# EAGLE board imix (EAGLE 7.5.0)
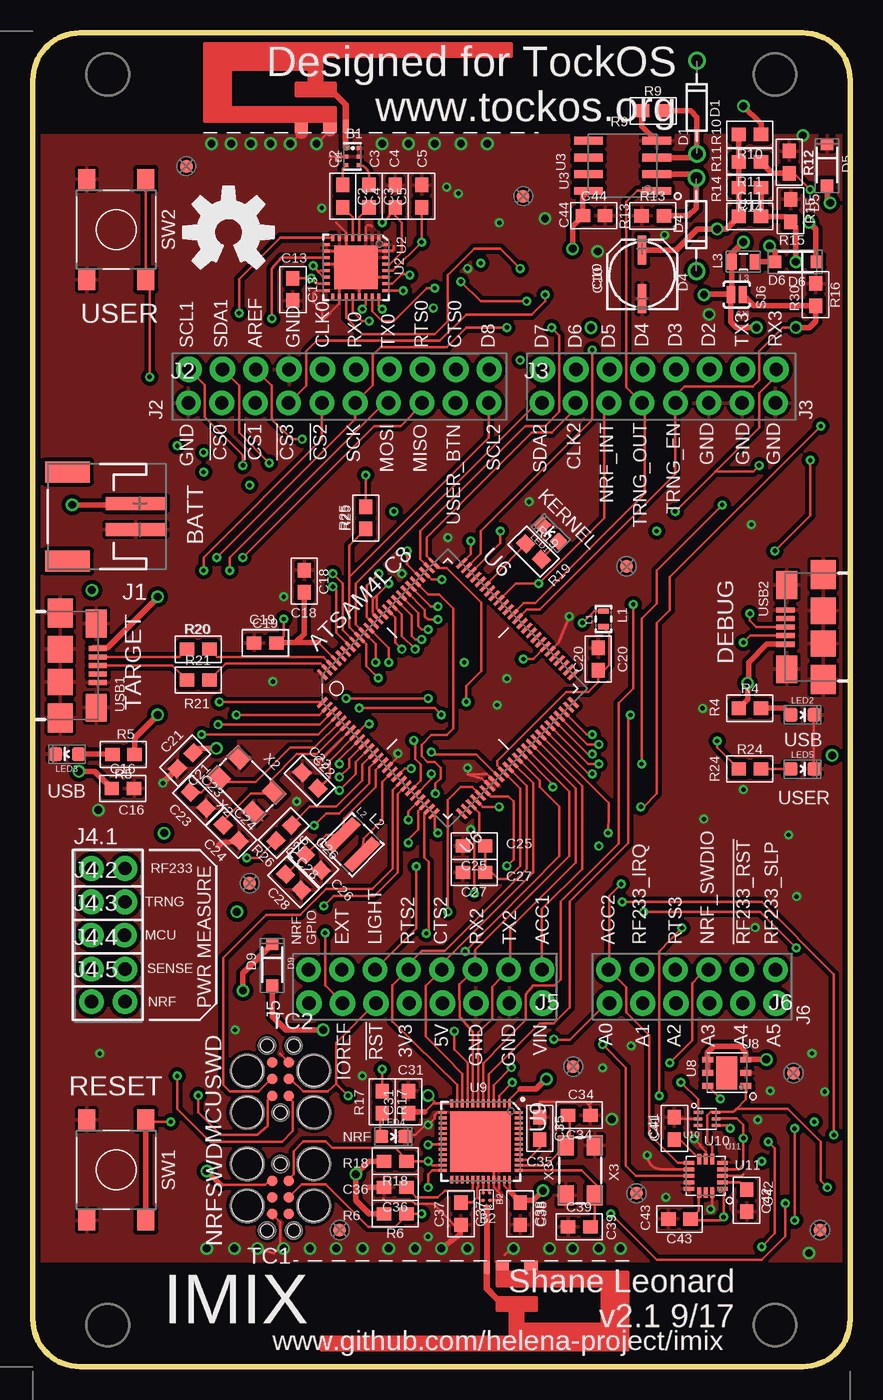
[diagram p8: board, top side]
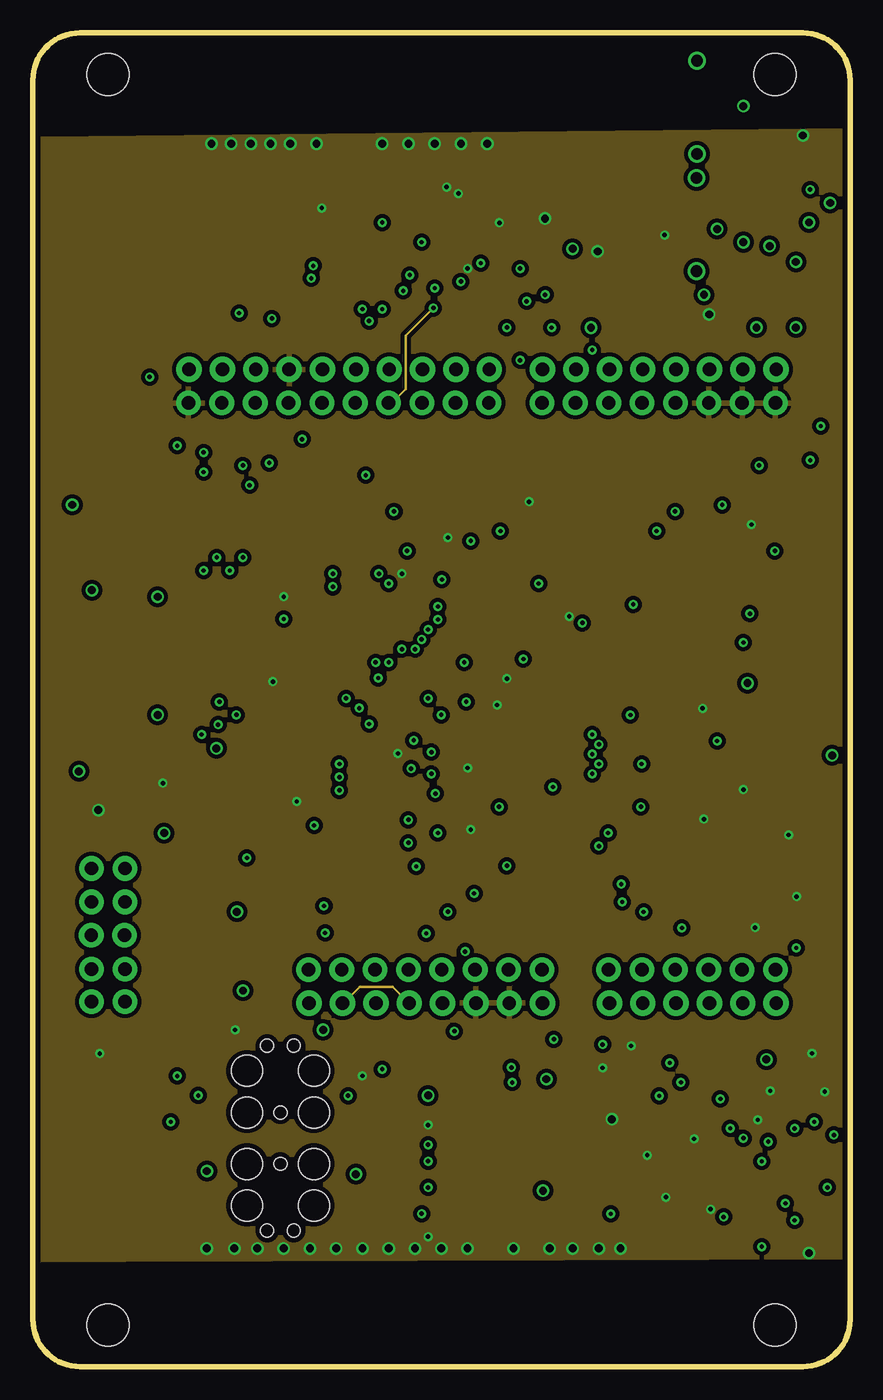
[diagram p9: board, inner layer Route2]
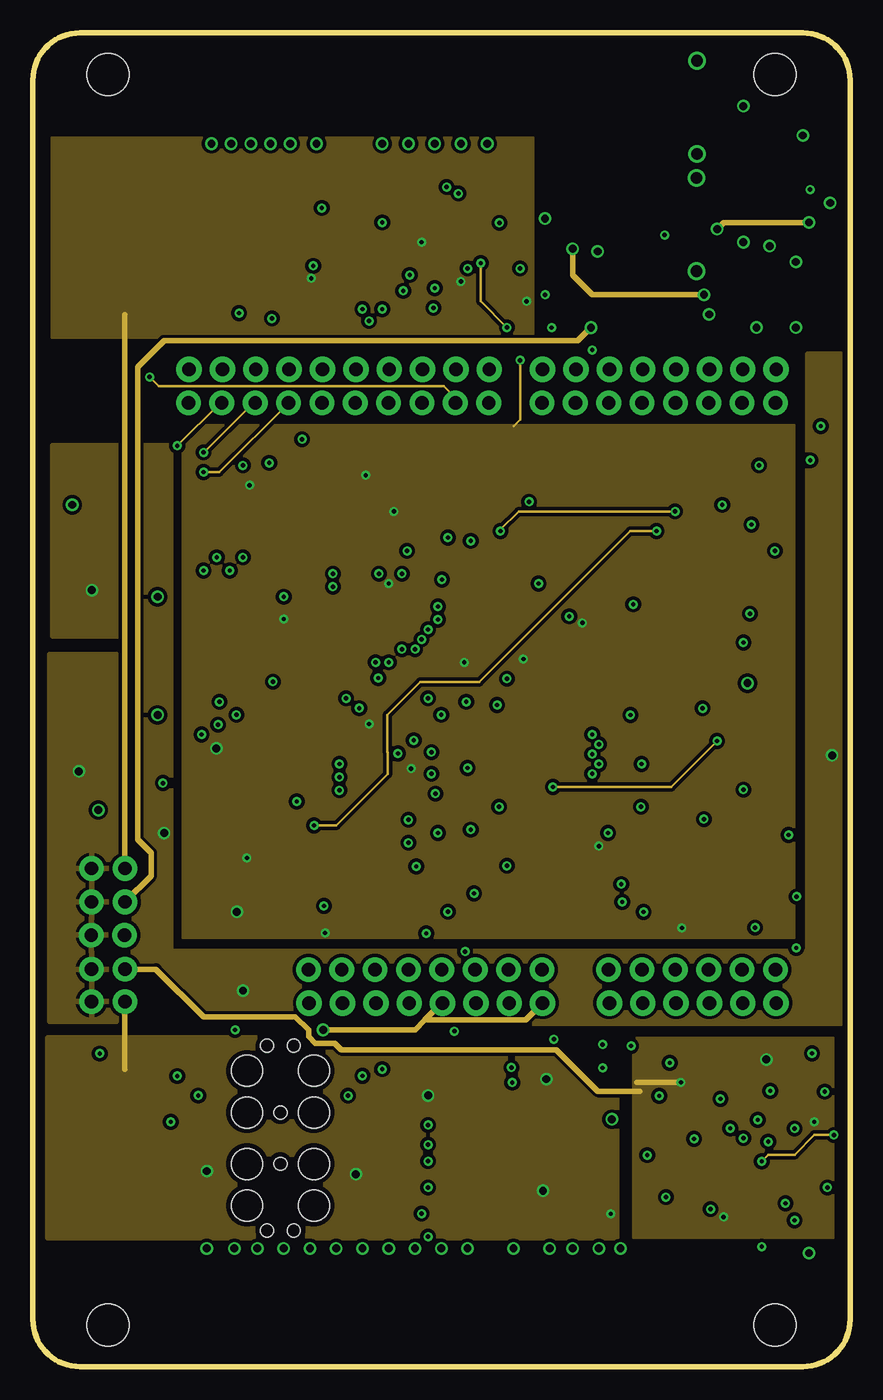
[diagram p10: board, inner layer Route15]
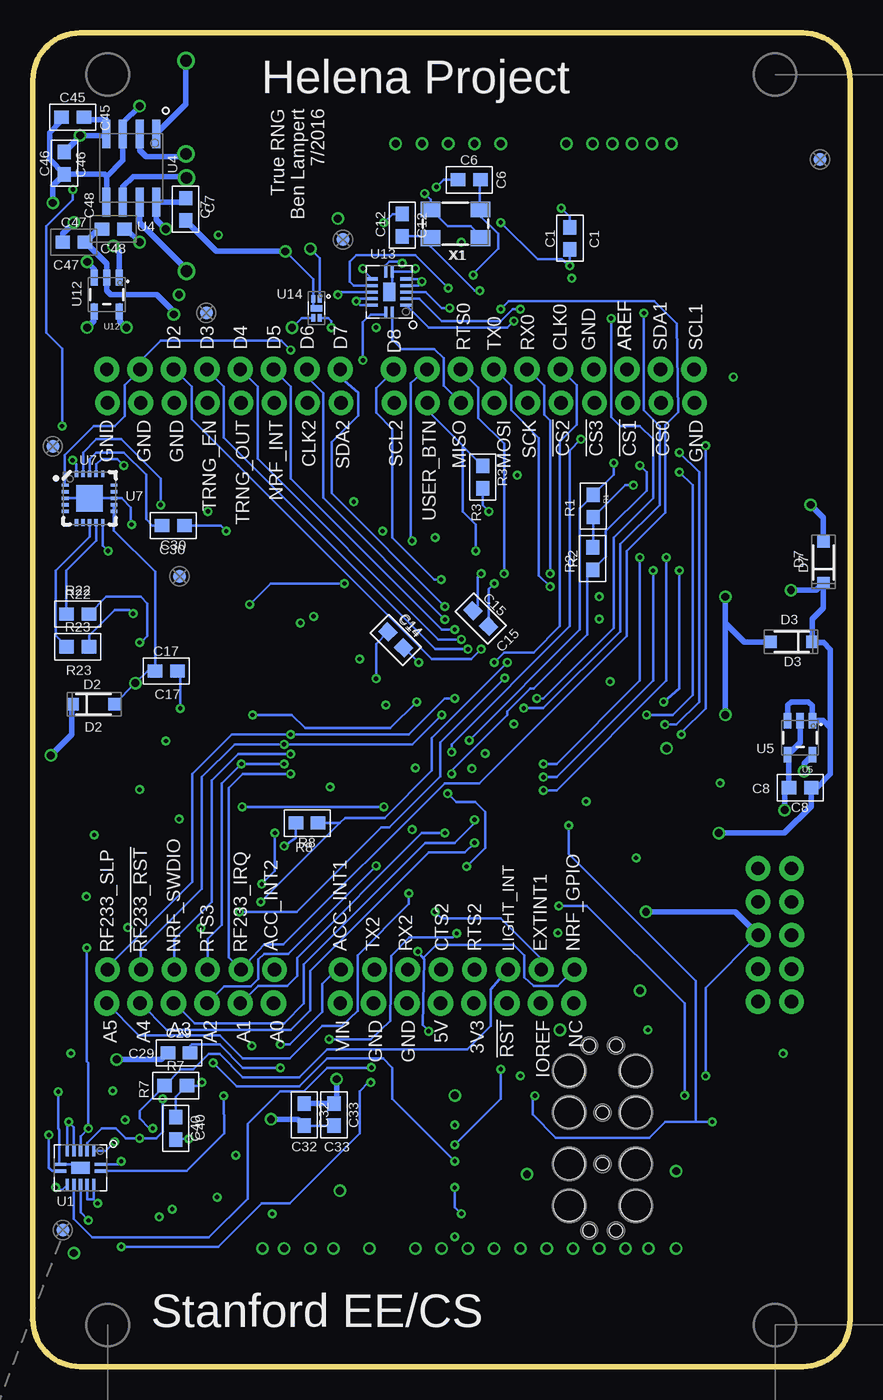
[diagram p11: board, bottom side, seen from below]

Size 62.23 x 101.6 mm. Coordinates in mm from the lower left corner, seen from the top.
Outline: 3.59,101.6 58.64,101.6 arc-90 62.23,98.01 62.23,3.59 arc-90 58.64,0 3.59,0 arc-90 0,3.59 0,98.01 arc-90 3.59,101.6
Copper layers (1+2*15+16): Top 0.0356mm / dielectric 9mil / Route2 0.0356mm / dielectric 40mil / Route15 0.0356mm / dielectric 9mil / Bottom 0.0356mm
Design rules "oshpark-2layer *": minimum track width 8mil, minimum drill 13mil, track to track 6mil, track to pad 6mil, pad to pad 6mil, via to via 6mil, smd to smd 6mil, copper to edge 15mil, drill to drill 6mil, minimum pad ring 7mil, minimum via ring 7mil, stop-mask expansion 2.5mil, vias tented up to drill 13mil, thermal gap 10mil
Net classes: 0 default: width 0.152 mm, drill 0.33 mm, clearance 0.152 mm; 1 power: width 0.152 mm, drill 0.33 mm, clearance 0.254 mm; 2 50ohm: width 0.152 mm, drill 0.33 mm, clearance 0.254 mm
Holes 3.2 mm at 5.71,98.42 56.52,98.42 5.71,3.17 56.52,3.17

## Footprints (pad centres in the part's own frame; a part is rotated, then mirrored left to right if it is on the bottom)
BALUN0805 = smd 0.3 x 0.3: 1 1.65,1.1; 2 1,1.1; 3 0.35,1.1; 4 0.35,0.15; 5 1,0.15; 6 1.65,0.15
BAL_NRF01D3 = smd 0.264 x 0.264: DIFF@1 0.219,0.25; DIFF@2 0.219,0.75; GND 0.819,0.75; SE 1.252,0.5; VCC 0.819,0.25
C0603 = smd 1.1 x 1: 1 -0.85,0; 2 0.85,0
PANASONIC_C = smd 2.2 x 0.65: + 1.9,-0.2; - -1.8,-0.2
C0603-NOSILK = smd 1.1 x 1: 1 -0.85,0; 2 0.85,0
DIODE-ZENER = drill 0.9: P$1 -3.556,0; P$2 3.556,0
SOD-123 = smd 0.9 x 0.95: A 1.575,0; C -1.575,0
JST-2-SMD = smd 1 x 4.6: 1 -1,-3.7; 2 1,-3.7 | smd 1.6 x 3.4: NC1 -3.4,1.5; NC2 3.4,1.5
1X10_NO_SILK = drill 1.016 pad 1.88: 1 0,0; 2 2.54,0; 3 5.08,0; 4 7.62,0; 5 10.16,0; 6 12.7,0; 7 15.24,0; 8 17.78,0; 9 20.32,0; 10 22.86,0
1X08_NO_SILK = drill 1.016 pad 1.88: 1 0,0; 2 2.54,0; 3 5.08,0; 4 7.62,0; 5 10.16,0; 6 12.7,0; 7 15.24,0; 8 17.78,0
1X02_NO_SILK = drill 1.016 pad 1.88: 1 0,0; 2 2.54,0
1X06_NO_SILK = drill 1.016 pad 1.88: 1 0,0; 2 2.54,0; 3 5.08,0; 4 7.62,0; 5 10.16,0; 6 12.7,0
ARDUINO_R3_NO_HOLES_NO_SPI = drill 1.016 pad 1.93: 3.3V 35.56,2.54; 5V 38.1,2.54; A0 50.8,2.54; A1 53.34,2.54; A2 55.88,2.54; A3 58.42,2.54; A4 60.96,2.54; A5 63.5,2.54; AREF 23.876,50.8; D0 63.5,50.8; D1 60.96,50.8; D2 58.42,50.8; D3 55.88,50.8; D4 53.34,50.8; D5 50.8,50.8; D6 48.26,50.8; D7 45.72,50.8; D8 41.656,50.8; D9 39.116,50.8; D10 36.576,50.8; D11 34.036,50.8; D12 31.496,50.8; D13 28.956,50.8; GND@1 40.64,2.54; GND@2 43.18,2.54; GND@3 26.416,50.8; IOREF 30.48,2.54; NC 27.94,2.54; RESET@1 33.02,2.54; SCL 18.796,50.8; SDA 21.336,50.8; VIN 45.72,2.54
L0603 = smd 0.4 x 0.8: 1 0.2,0.4; 2 1.4,0.4
L1212 = smd 0.9 x 3: 1 -1.05,0; 2 1.05,0
0805 = smd 0.8 x 1.2: 1 -0.9,0; 2 0.9,0
LED-0603 = smd 1 x 1: A 0,-0.877; C 0,0.877
0603-RES = smd 1.1 x 1: 1 -0.85,0; 2 0.85,0
SJ_2S-NO = smd 0.635 x 1.27: 1 -0.45,0; 2 0.45,0
TAC_SWITCH_6X6 = smd 1.55 x 1.3: 1 -3.825,2.25; 2 3.825,2.25; 3 -3.825,-2.25; 4 3.825,-2.25
TC2030-IDC = smd 0.787 x 0.787: 1 -1.27,-0.635; 2 -1.27,0.635; 3 0,-0.635; 4 0,0.635; 5 1.27,-0.635; 6 1.27,0.635 | hole 0.991: -2.54,0; 2.54,1.016; 2.54,-1.016 | hole 2.375: -2.54,2.54; -2.54,-2.54; 0.635,2.54; 0.635,-2.54
DHVQFN14 = smd 0.9 x 0.24: 1 -1.55,-0.25; 7 1.55,-0.25; 8 1.55,0.25; 14 -1.55,0.25 | smd 0.24 x 0.9: 2 -1,-1.3; 3 -0.5,-1.3; 4 0,-1.3; 5 0.5,-1.3; 6 1,-1.3; 9 1,1.3; 10 0.5,1.3; 11 0,1.3; 12 -0.5,1.3; 13 -1,1.3 | smd 1.4 x 0.9: PADDLE 0,0
32QN2 = smd 0.5 x 0.23: 1 -2.25,1.75; 2 -2.25,1.25; 3 -2.25,0.75; 4 -2.25,0.25; 5 -2.25,-0.25; 6 -2.25,-0.75; 7 -2.25,-1.25; 8 -2.25,-1.75; 17 2.25,-1.75; 18 2.25,-1.25; 19 2.25,-0.75; 20 2.25,-0.25; 21 2.25,0.25; 22 2.25,0.75; 23 2.25,1.25; 24 2.25,1.75 | smd 0.23 x 0.5: 9 -1.75,-2.25; 10 -1.25,-2.25; 11 -0.75,-2.25; 12 -0.25,-2.25; 13 0.25,-2.25; 14 0.75,-2.25; 15 1.25,-2.25; 16 1.75,-2.25; 25 1.75,2.25; 26 1.25,2.25; 27 0.75,2.25; 28 0.25,2.25; 29 -0.25,2.25; 30 -0.75,2.25; 31 -1.25,2.25; 32 -1.75,2.25 | smd 3.3 x 3.3: PADDLE 0,0
SO8 = smd 0.6 x 2.2: 1 -1.905,-2.6; 2 -0.635,-2.6; 3 0.635,-2.6; 4 1.905,-2.6; 5 1.905,2.6; 6 0.635,2.6; 7 -0.635,2.6; 8 -1.905,2.6
SOT23-5 = smd 0.55 x 1.2: 1 -0.95,-1.3; 2 0,-1.3; 3 0.95,-1.3; 4 0.95,1.3; 5 -0.95,1.3
TQFP100 = smd 1 x 0.25: 1 -7.5,6; 2 -7.5,5.5; 3 -7.5,5; 4 -7.5,4.5; 5 -7.5,4; 6 -7.5,3.5; 7 -7.5,3; 8 -7.5,2.5; 9 -7.5,2; 10 -7.5,1.5; 11 -7.5,1; 12 -7.5,0.5; 13 -7.5,0; 14 -7.5,-0.5; 15 -7.5,-1; 16 -7.5,-1.5; 17 -7.5,-2; 18 -7.5,-2.5; 19 -7.5,-3; 20 -7.5,-3.5; 21 -7.5,-4; 22 -7.5,-4.5; 23 -7.5,-5; 24 -7.5,-5.5; 25 -7.5,-6; 51 7.5,-6; 52 7.5,-5.5; 53 7.5,-5; 54 7.5,-4.5; 55 7.5,-4; 56 7.5,-3.5; 57 7.5,-3; 58 7.5,-2.5; 59 7.5,-2; 60 7.5,-1.5; 61 7.5,-1; 62 7.5,-0.5; 63 7.5,0; 64 7.5,0.5; 65 7.5,1; 66 7.5,1.5; 67 7.5,2; 68 7.5,2.5; 69 7.5,3; 70 7.5,3.5; 71 7.5,4; 72 7.5,4.5; 73 7.5,5; 74 7.5,5.5; 75 7.5,6 | smd 0.25 x 1: 26 -6,-7.5; 27 -5.5,-7.5; 28 -5,-7.5; 29 -4.5,-7.5; 30 -4,-7.5; 31 -3.5,-7.5; 32 -3,-7.5; 33 -2.5,-7.5; 34 -2,-7.5; 35 -1.5,-7.5; 36 -1,-7.5; 37 -0.5,-7.5; 38 0,-7.5; 39 0.5,-7.5; 40 1,-7.5; 41 1.5,-7.5; 42 2,-7.5; 43 2.5,-7.5; 44 3,-7.5; 45 3.5,-7.5; 46 4,-7.5; 47 4.5,-7.5; 48 5,-7.5; 49 5.5,-7.5; 50 6,-7.5; 76 6,7.5; 77 5.5,7.5; 78 5,7.5; 79 4.5,7.5; 80 4,7.5; 81 3.5,7.5; 82 3,7.5; 83 2.5,7.5; 84 2,7.5; 85 1.5,7.5; 86 1,7.5; 87 0.5,7.5; 88 0,7.5; 89 -0.5,7.5; 90 -1,7.5; 91 -1.5,7.5; 92 -2,7.5; 93 -2.5,7.5; 94 -3,7.5; 95 -3.5,7.5; 96 -4,7.5; 97 -4.5,7.5; 98 -5,7.5; 99 -5.5,7.5; 100 -6,7.5
QFN20 = smd 0.5 x 0.25: 1 -1.85,1; 2 -1.85,0.5; 3 -1.85,0; 4 -1.85,-0.5; 5 -1.85,-1; 11 1.85,-1; 12 1.85,-0.5; 13 1.85,0; 14 1.85,0.5; 15 1.85,1 | smd 0.25 x 0.5: 6 -1,-1.85; 7 -0.5,-1.85; 8 0,-1.85; 9 0.5,-1.85; 10 1,-1.85; 16 1,1.85; 17 0.5,1.85; 18 0,1.85; 19 -0.5,1.85; 20 -1,1.85 | smd 2 x 2: PADDLE 0,0
SI7021 = smd 0.85 x 0.45: 1 -1.45,1; 2 -1.45,0; 3 -1.45,-1; 4 1.45,-1; 5 1.45,0; 6 1.45,1 | smd 1.6 x 2.5: P$7 0,0
QFN48_6X6 = smd 0.6 x 0.2: 1 -2.9,2.2; 2 -2.9,1.8; 3 -2.9,1.4; 4 -2.9,1; 5 -2.9,0.6; 6 -2.9,0.2; 7 -2.9,-0.2; 8 -2.9,-0.6; 9 -2.9,-1; 10 -2.9,-1.4; 11 -2.9,-1.8; 12 -2.9,-2.2; 25 2.9,-2.2; 26 2.9,-1.8; 27 2.9,-1.4; 28 2.9,-1; 29 2.9,-0.6; 30 2.9,-0.2; 31 2.9,0.2; 32 2.9,0.6; 33 2.9,1; 34 2.9,1.4; 35 2.9,1.8; 36 2.9,2.2 | smd 0.2 x 0.6: 13 -2.2,-2.9; 14 -1.8,-2.9; 15 -1.4,-2.9; 16 -1,-2.9; 17 -0.6,-2.9; 18 -0.2,-2.9; 19 0.2,-2.9; 20 0.6,-2.9; 21 1,-2.9; 22 1.4,-2.9; 23 1.8,-2.9; 24 2.2,-2.9; 37 2.2,2.9; 38 1.8,2.9; 39 1.4,2.9; 40 1,2.9; 41 0.6,2.9; 42 0.2,2.9; 43 -0.2,2.9; 44 -0.6,2.9; 45 -1,2.9; 46 -1.4,2.9; 47 -1.8,2.9; 48 -2.2,2.9 | smd 4.6 x 4.6: PADDLE 0,0
ISL29035 = smd 0.65 x 0.25: 1 -0.675,0.5; 2 -0.675,0; 3 -0.675,-0.5; 4 0.675,-0.5; 5 0.675,0; 6 0.675,0.5
QFN16_3,5 = smd 0.8 x 0.3: 1 -1.275,1; 2 -1.275,0.5; 3 -1.275,0; 4 -1.275,-0.5; 5 -1.275,-1; 9 1.275,-1; 10 1.275,-0.5; 11 1.275,0; 12 1.275,0.5; 13 1.275,1 | smd 0.3 x 0.8: 6 -0.5,-1.275; 7 0,-1.275; 8 0.5,-1.275; 14 0.5,1.275; 15 0,1.275; 16 -0.5,1.275
TDFN4 = smd 0.3 x 0.55: 1 0.25,0.725; 2 -0.25,0.725; 3 -0.25,-0.725; 4 0.25,-0.725 | smd 0.86 x 0.5: PADDLE 0,0
DN007-2 = smd 0.46 x 1: FEED 2.22,-2.8 | smd 1.01 x 0.74: GND -1.16,-2.93; GND@1 1.035,-2.93
FIDUCIAL = smd 1 x 1: P$1 0,0
USB-AB-MICRO-SMD = smd 1.4 x 0.4: D+ 2.85,0; D- 2.85,0.65; GND 2.85,-1.3; ID 2.85,-0.65; VBUS 2.85,1.3 | smd 1.9 x 2.2: SHIELD1 0,4; SHIELD4 0,-4 | smd 1.9 x 2: SHIELD2 0,1.25; SHIELD3 0,-1.25 | smd 1.6 x 2.1: SHIELD5 2.75,3.2; SHIELD6 2.75,-3.2
CTS_405_SERIES = smd 1.5 x 1.2: 1 -1.9,-1.1; 3 1.9,1.1; CASE@2 -1.9,1.1; CASE@4 1.9,-1.1

## Placement (x,y rotation side)
B1  2450BM15A0015  [BALUN0805]  24.97,91.17 90 top
B2  BAL_NRF01D3  [BAL_NRF01D3]  34.05,13.47 270 top
C1  100nF  [C0603]  21.34,85.94 90 bottom
C2  22pF  [C0603]  23.6,89.15 270 top
C3  22pF  [C0603]  25.6,89.15 270 top
C4  100nF  [C0603]  27.6,89.15 90 top
C5  1uF  [C0603]  29.6,89.15 90 top
C6  9pF  [C0603]  29,90.4 0 bottom
C7  0.47uF  [C0603]  50.6,88.15 270 bottom
C8  4.7uF  [C0603]  3.81,44.09 180 bottom
C10  10uF  [PANASONIC_C]  46.2,83.15 90 top
C11  22pF  [C0603]  54.6,87.61 0 top
C12  9pF  [C0603]  34.1,86.95 270 bottom
C13  1uF  [C0603]  19.8,82.05 270 top
C14  100nF  [C0603]  34.59,55.36 315 bottom
C15  100nF  [C0603]  28.13,56.98 315 bottom
C16  1uF  [C0603]  6.86,44.04 0 top
C17  100nF  [C0603]  52.07,52.98 0 bottom
C18  10uF  [C0603]  20.66,59.82 270 top
C19  100nF  [C0603]  17.7,55.12 0 top
C20  100nF  [C0603]  43.05,53.9 90 top
C21  100nF  [C0603]  11.6,46.15 225 top
C22  100nF  [C0603]  21.1,44.65 315 top
C23  9pF  [C0603]  12.6,43.15 315 top
C24  9pF  [C0603]  15.1,40.65 315 top
C25  4.7uF  [C0603]  33.6,39.65 180 top
C26  6.8uF  [C0603]  21.35,38.4 315 top
C27  100nF  [C0603]  33.6,37.65 180 top
C28  100nF  [C0603]  19.85,36.9 315 top
C29  100nF  [C0603]  51.1,23.9 0 bottom
C30  1uF  [C0603]  51.53,64.06 180 bottom
C31  100 nF  [C0603]  28.6,20.15 90 top
C32  100 nF  [C0603]  41.56,19.2 270 bottom
C33  100nF  [C0603]  39.3,19.2 270 bottom
C34  9pF  [C0603]  41.6,19.15 180 top
C35  1 nF  [C0603]  38.6,18.15 270 top
C36  47 nF  [C0603]  27.6,13.65 180 top
C37  2.2 nF  [C0603]  32.6,11.65 270 top
C38  1 nF  [C0603]  37.1,11.65 270 top
C39  9pF  [C0603]  41.6,10.65 0 top
C40  100nF  [C0603]  51.35,18.15 270 bottom
C41  100nF  [C0603]  48.85,18.15 90 top
C42  100nF  [C0603]  54.35,12.65 270 top
C43  100nF  [C0603]  49.24,11.24 180 top
C44  0.47uF  [C0603]  42.73,87.66 0 top
C45  DNP  [C0603]  59.2,95.16 0 bottom
C46  0.47uF  [C0603]  59.83,91.68 90 bottom
C47  0.47uF  [C0603-NOSILK]  59.1,85.65 0 bottom
C48  4.7uF  [C0603-NOSILK]  56.1,86.65 180 bottom
D1  DIODE-ZENERPTH  [DIODE-ZENER]  50.57,95.92 270 top
D2  MBR0530 430mV@500mA  [SOD-123]  57.61,50.44 0 bottom
D3  MBR0530 430mV@500mA  [SOD-123]  4.46,55.21 180 bottom
D4  DIODE-ZENERPTH  [DIODE-ZENER]  50.53,86.99 90 top
D5  MBR0530  [SOD-123]  60.47,91.54 270 top
D6  MBR0530  [SOD-123]  58.1,84.15 180 top
D7  MBR0530 430mV@500mA  [SOD-123]  2.03,61.25 90 bottom
D9  MBR0530 430mV@500mA  [SOD-123]  18.23,30.63 270 top
J1  [JST-2-SMD]  4.15,64.75 90 top
J2  [1X10_NO_SILK]  11.85,73.41 0 top
J3  [1X08_NO_SILK]  38.77,73.41 0 top
J4.1  [1X02_NO_SILK]  4.47,37.95 0 top
J4.2  [1X02_NO_SILK]  4.47,35.39 0 top
J4.3  [1X02_NO_SILK]  4.45,32.87 0 top
J4.4  [1X02_NO_SILK]  4.47,30.27 0 top
J4.5  [1X02_NO_SILK]  4.47,27.81 0 top
J5  [1X08_NO_SILK]  38.76,30.24 180 top
J6  [1X06_NO_SILK]  56.54,30.24 180 top
JP1  ARDUINO_R3_NO_SPI  [ARDUINO_R3_NO_HOLES_NO_SPI]  -6.9,25.15 0 top
L1  BLM18HE152SN1  [L0603]  43.85,56.15 90 top
L2  22uH LQH3NPN220MJ0  [L1212]  24.32,39.76 315 top
L3  10uH  [0805]  54.1,84.15 180 top
LED1  [LED-0603]  39.42,63.49 45 top
LED2  [LED-0603]  58.6,49.65 270 top
LED3  [LED-0603]  2.6,46.65 90 top
LED4  [LED-0603]  27.45,17.53 270 top
LED5  [LED-0603]  58.6,45.52 270 top
R1  10K  [0603-RES]  19.55,65.56 270 bottom
R2  10K  [0603-RES]  19.61,61.56 90 bottom
R3  10K  [0603-RES]  27.97,67.75 270 bottom
R4  220  [0603-RES]  54.6,50.15 0 top
R5  220  [0603-RES]  6.9,46.63 180 top
R6  10K  [0603-RES]  27.6,11.65 180 top
R7  10K  [0603-RES]  51.35,21.4 0 bottom
R8  10K  [0603-RES]  41.35,41.4 180 bottom
R9  10K  [0603-RES]  47.23,95.65 0 top
R10  10K  [0603-RES]  54.6,93.86 180 top
R11  150K  [0603-RES]  54.6,91.76 180 top
R12  30K  [0603-RES]  57.6,91.74 270 top
R13  10K  [0603-RES]  47.2,87.65 0 top
R14  2.2M  [0603-RES]  54.6,89.81 180 top
R15  160K  [0603-RES]  57.7,88.06 270 top
R16  10K  [0603-RES]  59.6,81.65 270 top
R17  220  [0603-RES]  26.6,20.15 270 top
R18  10K  [0603-RES]  27.6,15.65 180 top
R19  220  [0603-RES]  38.12,62.1 315 top
R20  27  [0603-RES]  12.59,54.65 0 top
R21  27  [0603-RES]  12.59,52.3 0 top
R22  27  [0603-RES]  58.8,57.33 0 bottom
R23  27  [0603-RES]  58.8,54.83 0 bottom
R24  220  [0603-RES]  54.6,45.52 0 top
R25  10K  [0603-RES]  25.35,64.65 90 top
R26  10K  [0603-RES]  19.1,40.65 225 top
SJ6  SOLDERJUMPERNO  [SJ_2S-NO]  53.6,81.65 180 top
SW1  PTS645SM43SMTR92_LFS  [TAC_SWITCH_6X6]  6.35,14.99 270 top
SW2  PTS645SM43SMTR92_LFS  [TAC_SWITCH_6X6]  6.35,86.61 270 top
TC1  TC2030-IDC  [TC2030-IDC]  18.85,12.9 270 top
TC2  TC2030-IDC  [TC2030-IDC]  18.85,21.9 90 top
U1  74LVC4066BQ  [DHVQFN14]  58.6,15.15 180 bottom
U2  [32QN2]  24.6,83.73 270 top
U3  TLV3202  [SO8]  44.91,91.46 90 top
U4  LM358  [SO8]  54.73,91.3 180 bottom
U5  LDO-TPS78233  [SOT23-5]  3.81,47.9 180 bottom
U6  ATSAM4LCX_100  [TQFP100]  31.6,51.65 45 top
U7  [QFN20]  57.91,66.14 0 bottom
U8  SI7021  [SI7021]  52.84,22.39 180 top
U9  NRF51422  [QFN48_6X6]  34.1,17.15 270 top
U10  ISL29035  [ISL29035]  51.34,18.87 0 top
U11  FX0S8700CQ  [QFN16_3,5]  51.24,14.54 180 top
U12  296-12686-1-ND  [SOT23-5]  56.6,81.65 180 bottom
U13  74LVC4066BQ  [DHVQFN14]  35.1,81.85 90 bottom
U14  SIP32401A  [TDFN4]  40.64,80.6 0 bottom
U$1  INVERTED_F_ANTENNA-2  [DN007-2]  21.6,97.3 0 top
U$2  FIDUCIAL  [FIDUCIAL]  41.15,22.86 0 top
U$3  FIDUCIAL  [FIDUCIAL]  23.37,10.41 0 top
U$4  INVERTED_F_ANTENNA-2  [DN007-2]  36.78,4.77 180 top
U$5  FIDUCIAL  [FIDUCIAL]  45.97,13.21 0 top
U$6  FIDUCIAL  [FIDUCIAL]  57.91,22.35 0 top
U$7  FIDUCIAL  [FIDUCIAL]  16.51,36.83 0 top
U$8  FIDUCIAL  [FIDUCIAL]  45.21,60.96 0 top
U$9  [OSHW-LOGO-L]  14.9,86.4 0 top
U$10  FIDUCIAL  [FIDUCIAL]  37.34,89.15 0 top
U$11  FIDUCIAL  [FIDUCIAL]  51.05,60.2 0 bottom
U$12  FIDUCIAL  [FIDUCIAL]  60.71,70.1 0 bottom
U$13  FIDUCIAL  [FIDUCIAL]  38.61,85.85 0 bottom
U$14  FIDUCIAL  [FIDUCIAL]  49.02,80.26 0 bottom
U$15  FIDUCIAL  [FIDUCIAL]  2.29,91.95 0 bottom
U$16  FIDUCIAL  [FIDUCIAL]  59.94,10.41 0 bottom
U$17  FIDUCIAL  [FIDUCIAL]  59.94,10.41 0 top
U$18  FIDUCIAL  [FIDUCIAL]  11.68,91.44 0 top
USB1  [USB-AB-MICRO-SMD]  2.1,53.4 0 top
USB2  [USB-AB-MICRO-SMD]  60.17,56.33 180 top
X1  16MHz  [CTS_405_SERIES]  30.05,87.05 180 bottom
X2  16MHz  [CTS_405_SERIES]  16.26,44.29 135 top
X3  16MHz  [CTS_405_SERIES]  41.69,14.95 90 top

## Tracks (layer width: path | path; a pad name or v marks a point on that pad's centre or on a via)
!RESET  (via drill 0.33)
  Top 0.203: U6.13 25.6,45.65 25.6,44.4 23.35,42.15 22.35,42.15 v21.42,41.22 | 23.1,21.54 23.1,24.67 JP1.RESET@1 | TC2.3 19.6,21.9 20.6,20.95 22.46,20.95 23.1,21.54 | 23.1,21.54 v24,20.64 | v10.5,18.64 8.5,18.64 8.56,18.71 SW1.1
  Top 0.406: SW1.2 SW1.1
  Route15 0.203: v47.5,63.64 45.5,63.64 34,52.14 29.5,52.14 27,49.64 27,46.8 27.03,46.78 27.03,45.16 23.09,41.22 v21.42,41.22
  Bottom 0.203: C30.1 47.92,64.06 v47.5,63.64 | v21.42,41.22 21.42,39.06 11.73,29.38 11.73,18.64 | 11.73,18.64 14.07,18.64 15.29,17.42 22.4,17.42 24.18,19.2 24.18,20.46 v24,20.64 | 11.73,18.64 v10.5,18.64
ACC_INT1  (via drill 0.33)
  Top 0.203: U6.42 41.85,44.23 41.85,37.9 41.82,37.9 38.76,34.85 J5.1 | U11.11 45.91,14.54 45.16,15.29 45.16,22.76 v43.38,24.54
  Bottom 0.203: J5.1 39.1,30.24 40.18,29.16 40.18,27.03 42.67,24.54 v43.38,24.54
ACC_INT2  (via drill 0.33)
  Top 0.203: U6.43 43.84,42.95 43.84,42.19 v43.8,40.65 | U11.9 49.1,15.54 46.94,17.7 46.94,25.25 45.2,26.99 45.2,28.88 J6.6 43.9,30.3 43.9,35.85 v44.8,36.75
  Bottom 0.203: v43.8,40.65 43.8,37.75 v44.8,36.75
ADCIFE0  (via drill 0.33)
  Top 0.203: U6.24 29.8,42.08 29.8,38.8 30.15,38.45 30.15,33.2 v29.95,33 | JP1.A0 43.7,27.69 40.89,24.89 39.73,24.89 v39.68,24.95
  Bottom 0.203: v29.95,33 30.25,32.7 33.55,32.7 34.95,31.3 35,26.34 36.5,24.95 v39.68,24.95
ADCIFE1  (via drill 0.33)
  Top 0.203: U6.25 30.54,42.09 30.6,42.03 30.6,40.9 v30.85,40.65
  Bottom 0.203: v30.85,40.65 32.6,40.65 42.1,31.15 42.1,29.75 42.85,29 45.07,29 46.38,27.69 JP1.A1
ADCIFE2  (via drill 0.33)
  Top 0.203: v36.1,38.15 36.6,38.65 36.6,43.04 36.2,43.44 34.86,43.44 U6.31
  Bottom 0.203: v36.1,38.15 42.8,31.45 44.6,31.45 45.05,31 45.05,29.55 45.65,28.95 47.66,28.95 48.92,27.69 JP1.A2
ADCIFE3  (via drill 0.33)
  Top 0.203: U6.22 28.6,42.29 v28.6,41.65
  Bottom 0.203: v28.6,41.65 28.6,41.4 30.1,39.9 32.35,39.9 41.6,30.65 41.6,27.65 43.1,26.15 49.92,26.15 51.46,27.69 JP1.A3
ADCIFE4  (via drill 0.33)
  Top 0.203: U6.23 29.35,42.33 29.35,40.9 28.6,40.15 v28.6,39.9
  Bottom 0.203: v28.6,39.9 29.35,39.15 32.1,39.15 41.1,30.15 41.1,27.15 42.6,25.65 52.02,25.65 JP1.A4
ADCIFE5  (via drill 0.33)
  Top 0.203: v33.6,36.04 33.62,36.07 33.62,40.27 34,40.64 34,42.18 U6.28
  Bottom 0.203: v33.6,36.04 33.6,35.24 37.5,31.34 37.5,27.12 38.71,25.96 40.18,25.96 42.67,23.47 46.23,23.47 48.01,25.25 54.15,25.25 JP1.A5
AREF  (via drill 0.33)
  Top 0.203: v30.35,46.8 30.51,46.64 33.78,46.64 U6.34 | v20.5,70.64 19.7,70.64 18.2,72.14 18.2,74.73 JP1.AREF
  Bottom 0.203: v30.35,46.8 30.35,47.4 21.35,56.4 21.35,69.79 v20.5,70.64
BUCK/BOOST
  Top 0.203: U6.12 25.1,45.86 25.1,44.65 23.1,42.65 21.1,42.65 R26.1
DTR
  Bottom 0.203: U7.18 57.9,68 57.9,69.14 57.4,69.64 55.3,69.64 53.6,67.94 53.6,64.54 53.12,64.06 C30.2
EXTINT1  (via drill 0.33)
  Top 0.203: U6.30 33.44,44.15 32.6,44.15 31.6,43.15 v31.6,34.65
  Bottom 0.203: v31.6,34.65 31.1,34.15 26.6,34.15 23.52,31.07 J5.7
GND  (via drill 0.33, 0.6)
  Top 0.203: U6.56 40.05,55.15 v40.85,57.15 | 17.48,41.59 X2.CASE@2 | U9.PADDLE 35.1,16.15 U9.33 35.1,13.65 35.35,13.4 | 35.35,13.4 35.6,13.15 35.6,12.65 B2.GND | U2.27 25.35,82.98 25.14,83.19 | 25.35,83.4 25.14,83.19 | v17.1,9.01 18.35,8.65 18.85,9.15 18.85,11 TC1.5 | LED4.C 28.44,17.65 29.1,17.65 30.1,18.65 v30.1,18.4 30.6,18.9 30.6,19.15 30.8,19.35 U9.13 | 38.6,19.4 C35.1 38.6,20.15 42.1,20.15 42.45,19.8 C34.1 | 31.6,10.65 31.66,10.72 | 20.6,44.9 C22.1 | U6.7 21.6,45.9 | 24.6,83.65 U2.PADDLE | U9.34 35.5,13.55 35.35,13.4 | 42.45,20 42.6,20.15 | U2.3 25.35,86.8 25.5,86.95 25.7,86.95 25.8,86.85 | U2.31 27.02,84.98 | U6.33 34.56,45.15 34.25,45.15 33.1,45.1 | B1.2 22.62,92.17 | 54.1,14.65 54,14.55 52.5,14.55 | U10.2 48.98,18.87 C41.2 | U11.16 51.74,12.21 | U6.15 27.8,46.44 v27.8,46.7 | U6.32 34.2,44.81 33.1,45.1 | 33.1,45.1 v33.1,45.6 | C37.2 32.07,10.8 30.48,12.39 29.11,12.39 28.85,12.65 26.82,12.65 26.67,12.8 | v36.6,9.01 36.04,8.65 35.92,8.53 | v21.6,93.15 22.64,94.19 | U2.12 24.12,83.98 | 24.12,83.98 24.18,83.92 24.4,83.92 U2.PADDLE | U2.10 23.82,84.98 | 23.82,84.98 24.17,84.98 24.18,84.99 24.18,84.03 24.12,83.98 | U2.21 24.85,83.48 U2.PADDLE | 25.14,83.19 U2.PADDLE | 27.5,85.35 27.5,85.11 27.38,84.99 25.86,84.99 U2.PADDLE | TC2.5 19.48,23.19 18.85,23.82 | U11.7 51.24,16.38 50.8,16.82 50.8,16.9 v50.35,17.35 | 23.82,84.98 23.85,85 U2.6 23.85,86.39 23.11,87.12 | 24.12,83.98 24.12,84.69 23.82,84.99 23.82,83.57 23.35,83.09 U2.18 23.35,80.95 22.05,79.65 22.05,80.37 21.34,81.08 21.34,81.79 21.53,81.98 U2.16 | U11.10 47.86,15.04 arc-90 v46.78,16.12 | LED5.C LED2.C | 20.44,93.99 v19.6,93.15
  Top 0.406: C37.2 32.53,10.08 v31.1,9.01 | C24.2 14.34,39.89 14.1,39.65 | C36.2 25.6,13.65 | R9.1 46.38,94.5 U3.4 | C21.2 v9.9,44.45 | R12.1 57.6,92.75
  Top 1: 20.44,93.99 U$1.GND | 22.64,94.19 U$1.GND@1
  Bottom 0.203: C40.2 51.3,17.35 v50.35,17.35 | C15.1 28.35,57.97 28.35,60.15 v28.1,60.4 | C14.1 36.1,55.06 v36.1,52.4 | X1.CASE@4 32.1,88 | X1.CASE@2 28.15,86.1 28.9,86.85 30.65,86.85 X1.CASE@4 | X1.CASE@4 31.95,88.9 v32.4,89.35 | C1.2 21.34,87.59 v22,88.25 | C6.1 30.95,90.4 v31.5,89.85 | v33.1,83.65 33.35,83.4 U13.7 34.85,82.1 U13.PADDLE | 51,53.2 C17.2 51,52.76 v51,50.14 | U14.PADDLE 40.89,80.85 U14.2 40.89,82.84 v43,84.95 | 58.85,15.4 arc90 U1.PADDLE 58.85,15.4 | 58.85,15.4 U1.7 60.2,15.45 60.2,18.04 60.3,18.14 v60.3,20.94 | U7.3 U7.PADDLE U7.13 55.48,66.14 54.76,65.43 54.76,64.2 v54.71,64.14 | C33.2 C32.2 | C29.2 50.25,24.43 50.14,24.54 48.01,24.54 46.23,22.76 v43.38,22.76 | C12.1 34.84,87.8 v35.52,87.12
  Bottom 0.406: C7.2 48.25,84.95 v43,84.95 | C48.2 57.25,86.65 C47.2 56.6,84 U12.2 56.6,81.95 56.3,81.65 52.8,81.65 51.5,80.35 v51.5,80.15 | U5.2 3.81,47.55 U5.4 4.66,46.5 C8.2 4.76,44.19 4.98,43.97 v4.98,42.4 | C32.2 42.06,18.85 v44.09,18.85 | 59.88,92.53 C46.2 58.63,93.72 v58.63,93.78 56.76,93.78 U4.4 56.64,95 58.18,95 C45.2
  other vias: 13.6,93.15 26.6,93.15 32.6,93.15 34.6,93.15 16.6,93.15 13.24,9.01 15.35,9.01 19.1,9.01 21.1,9.01 23.1,9.01 25.1,9.01 27.1,9.01 29.1,9.01 33.1,9.01 39.35,9.01 41.1,9.01 43.1,9.01 44.74,9.01 59.1,8.65 19.1,58.65 15.1,93.15 18.1,93.15 25.1,22.15 30.1,9.9 54.1,43.95 51.1,41.7 59.33,23.86 51.61,12 20.1,43.05 35.35,50.4 33.35,40.9 28.6,93.15 30.6,93.15 55.2,18.8 45.55,24.44 58.15,35.8 54.99,33.45 57.55,40.5 31.6,63.15 5.1,23.85 15.4,25.65 39,87.45 37.79,65.88 56.15,21 48.21,12.92 48.1,86.2 18.28,52.18
  pour Route2 (isolate 0.305): -3.09,93.44 -4.09,8.15 62.6,8.37 62.6,94.15
  pour Top (isolate 0.305): -7.06,93.8 70.76,93.8 70.1,8.01 -7.42,8.01
GPIO2  (via drill 0.33)
  Top 0.203: U6.86 27.6,57.07 27.6,55.15 v28.1,54.65
  Bottom 0.203: v28.1,54.65 28.85,53.9 31.85,53.9 46.6,68.65 46.61,68.65 50.14,72.19 50.14,74.63 51.46,75.95 JP1.D2
GPIO3  (via drill 0.33)
  Top 0.203: v29.1,54.65 28.1,55.65 28.1,57.28 U6.85
  Bottom 0.203: v29.1,54.65 31.6,54.65 47.7,70.75 47.7,74.64 48.98,75.92 JP1.D3
GPIO4  (via drill 0.33)
  Top 0.203: v29.6,55.4 29.1,55.4 28.85,55.65 28.85,57.23 U6.84
  Bottom 0.203: v29.6,55.4 31.35,55.4 45.1,69.15 45.1,74.65 46.38,75.93 46.42,75.93 JP1.D4
GPIO5  (via drill 0.33)
  Top 0.203: U6.83 28.06,58.69 29.35,57.4 29.35,56.4 29.6,56.15 v30.1,56.15
  Bottom 0.203: JP1.D5 42.6,74.65 42.6,72.15 42.59,72.14 42.59,67.64 31.1,56.15 v30.1,56.15
GPIO6  (via drill 0.33)
  Top 0.203: 30.6,56.9 v30.85,56.9 30.1,56.9 29.85,57.15 29.85,57.65 U6.82
  Bottom 0.203: v30.85,56.9 40.13,66.19 40.13,71.69 40.1,71.72 40.1,74.15 41.36,75.41 JP1.D6
GPIO7  (via drill 0.33)
  Top 0.203: U6.81 30.3,57.9 v30.85,57.9
  Bottom 0.203: JP1.D7 38.82,75.37 38.76,75.31 37.45,74.18 37.45,72.43 39.47,70.41 39.47,66.53 v30.85,57.9
GPIO8  (via drill 0.33)
  Top 0.203: v31.15,59.95 30.37,59.95 U6.78
  Bottom 0.203: v31.15,59.95 31.65,59.95 34.85,63.15 34.85,71.4 36.1,72.65 36.1,74.55 34.76,75.89 JP1.D8
KERNEL_LED
  Top 0.203: U6.70 R19.1
LIGHT_!INT  (via drill 0.33)
  Top 0.203: U10.4 52.88,18.37 v53.1,18.15 | U6.80 30.11,58.8 30.95,58.8 32,57.75 32,48.6 31.5,48.1 30.35,48.1 29.6,47.35 29.6,46.5 30.05,46.05 30.6,46.05 31.05,45.6 31.05,44.8 30.65,44.4 v30.65,43.65 | v29.2,38.1 29.2,33.38 J5.6
  Bottom 0.203: J5.6 27.37,28.73 27.36,26.81 27.38,26.81 27.38,25.96 29.16,24.18 39.83,24.18 41.96,22.05 46.23,22.05 48.01,23.82 48.82,23.82 50,22.64 50.96,22.64 R7.1 54.1,19.5 54.1,18.9 53.35,18.15 v53.1,18.15 | v30.65,43.65 30,43 28.55,43 27.8,42.25 27.8,39.5 v29.2,38.1
MCU_VOUT3.3
  Top 0.203: U6.16 26.6,44.53 26.6,41.65 25.18,40.23 L2.2
MISO  (via drill 0.33)
  Top 0.203: U6.9 23.35,46.23 v23.35,45.9 | v16,61.64 26,71.64 28,71.64 29.63,73.27 J2.8
  Bottom 0.203: v23.35,45.9 22.35,45.9 16,52.25 v16,61.64 | U13.1 34.85,78.23 34.14,77.52 31.65,77.52 30.94,76.81 30.94,74.72 J2.8
MOSI  (via drill 0.33)
  Top 0.203: U6.10 24.1,46.28 24.1,45.65 v23.35,44.9 | v15,60.64 15,61.64 26.77,73.41 J2.7
  Route2 0.203: v30.5,80.64 28.4,78.54 28.4,74.44 27.37,73.41 J2.7
  Bottom 0.203: v23.35,44.9 22.35,44.9 15,52.25 v15,60.64 | U13.4 32.3,81.85 31.09,80.64 v30.5,80.64
N$1
  Top 0.203: U2.5 24.35,87.56 C2.2
N$2  (via drill 0.33)
  Top 0.203: U2.29 27.17,83.98 28.1,84.9 28.1,87.15 27.6,87.65 C4.1 26.75,87.15 v26.6,87.15 | U2.14 22.13,82.98 21.78,83.37 | 21.78,83.37 v21.35,83.85 | U2.13 21.89,83.48 21.78,83.37
  Bottom 0.203: C1.1 21.35,85.08 v21.35,83.85 21.95,84.35 23.8,84.35 v26.6,87.15
N$3
  Top 0.203: USB1.D- 11.14,54.05 R20.1
N$4  (via drill 0.33)
  Top 0.203: U2.26 27.36,82.48 28.09,83.21 28.64,83.21 v28.7,83.15
  Bottom 0.203: v28.7,83.15 28.7,83.25 26.8,85.15 26.8,86.31 28.1,87.55 28.1,88.1 X1.1 28.2,88.15 28.2,89.8 C6.2
N$5
  Top 0.203: 34.55,7.62 U$4.FEED | 34.55,12.16 B2.SE
  Top 0.46: 34.55,12.16 U$4.FEED
N$6
  Top 0.203: B2.VCC 34.1,12.65 33.85,12.9 | 33.85,12.9 33.85,13.65 33.9,13.7 U9.30 | C37.1 33.45,12.5 33.85,12.9
N$7
  Top 0.203: U9.38 39.09,15.35 X3.3 40.89,17.15 40.89,19.02 C34.2
N$8  (via drill 0.33)
  Top 0.203: v59.2,69.04 59.2,64.84 v56.5,62.14
  Bottom 0.203: U7.20 58.91,68.75 v59.2,69.04 | v56.5,62.14 56.91,62.55 U7.10
N$9
  Top 0.203: U9.37 41.8,14.95 43.1,13.65 43.1,13.37 X3.1 42.79,10.99 C39.2
N$10
  Top 0.203: C25.1 C27.1 34.95,37.65 35.45,37.15 36.1,37.15 37.1,38.15 37.1,44.03 U6.35 35.35,45.78 35.35,46.15 40.6,51.4 42.3,51.4 43.05,52.15 C20.1 43.5,53.05 43.9,53.45 43.9,55.85 L1.1
N$11
  Top 0.203: U6.6 23.77,48.83 21.6,46.65 20.1,46.65 18.1,44.65 18.1,43.61 | 18.1,43.61 X2.1 | 18.1,43.61 18.05,43.65 16.6,43.65 14.55,41.6 C24.1
N$12
  Top 0.203: U6.14 26.1,45.45 26.1,44.15 23.69,41.75 L2.1 | C28.1 20.77,38.91 C26.1 22.35,40.5 L2.1 | 22.85,40.5 L2.1
N$13
  Top 0.203: U6.5 21.44,47.15 19.6,47.15 16.98,44.53 14.47,44.53 X2.3 13.93,44.86 12.83,43.76 C23.1
N$14
  Top 0.203: R19.2 LED1.A
N$15
  Top 0.203: U9.39 37.7,15.75 38.6,16.65 C35.2
N$16
  Top 0.406: R4.2 57.22,50.15 LED2.A
N$17
  Top 0.203: U2.4 24.85,87.55 C3.2
N$18
  Top 0.406: LED3.A 6.03,46.65 R5.2
N$19
  Top 0.203: U9.29 33.5,13.55 33.35,13.4 31.35,13.4 30.85,12.9 29.2,12.9 C36.1 28.1,13.28
N$20  (via drill 0.33)
  Top 0.203: USB2.D- 54.63,55.68 v54.1,55.15
  Bottom 0.203: R22.2 56.64,58.64 54,58.64 53.5,58.14 53.5,55.64 53.99,55.15 v54.1,55.15
N$21
  Top 0.152: B2.DIFF@1
  Top 0.203: U9.31 B2.DIFF@1
N$22
  Top 0.203: B1.3 23.6,91.25 C2.1
N$23
  Top 0.203: U9.32 34.7,13.35 B2.DIFF@2
N$24
  Bottom 0.203: 60,57.68 R22.1 59.69,57.33 59.69,60.65 57.4,62.94 U7.9
N$26  (via drill 0.33)
  Top 0.203: USB2.D+ 55.42,56.33 55.41,56.34 55.1,56.34 54.6,56.84 v54.6,57.35
  Bottom 0.203: R23.2 57.95,55.69 56,57.64 54.89,57.64 v54.6,57.35
N$29
  Top 0.203: R24.2 LED5.A
N$30
  Bottom 0.203: R23.1 60.5,55.68 60.5,60.64 57.91,63.23 U7.8
N$32  (via drill 0.6)
  Route15 0.406: J4.2.2 9,37.38 9,39.14 8,40.14 8,76.14 10,78.14 41.5,78.14 v42.5,79.14
  Bottom 0.203: U14.3 41.77,79.88 v42.5,79.14
N$34
  Top 0.203: USB1.D+ 10.63,53.4 R21.1
N$40  (via drill 0.33)
  Top 0.203: v28.2,81.95 28.18,81.98 U2.25
  Bottom 0.203: 31.95,85.7 X1.3 | v28.2,81.95 28.6,81.95 31.95,85.3 X1.3 | X1.3 32.2,86.1 C12.2
N$41
  Top 0.203: C3.1 25.6,90.74 arc90 B1.4
N$42
  Top 0.47: B1.1 23.82,92.87 U$1.FEED
N$43  (via drill 0.6)
  Top 0.406: L3.1 D6.A 56.52,84.93 v56.1,85.35
  Bottom 0.406: U12.1 55.65,84.9 v56.1,85.35
N$46  (via drill 0.6)
  Top 0.406: R14.1 C11.2 57.3,87.61 R15.2 58.1,86.81 v58.1,84.15
  Bottom 0.406: U12.3 57.55,83.6 v58.1,84.15
N$51
  Bottom 0.406: U4.1 50.57,96.16 D1.P$1
N$52
  Bottom 0.406: U4.7 54.1,87.15 50.53,83.58 D4.P$1 50.6,83.51
N$61
  Top 0.203: C41.1 49.25,17.3 U11.8
N$62
  Top 0.203: U11.2 53.81,14.04 C42.1
N$66  (via drill 0.6)
  Top 0.406: R10.1 55.45,94.66 v54.1,96.01 | D5.A 60.47,88.88 v60.71,88.65
  Bottom 0.406: 56.6,90.65 55.37,91.88 U4.3 55.37,94.74 v54.1,96.01 | 56.6,90.65 56.6,88.74 U4.5 | C46.1 56.77,90.83 56.6,90.65 | 60.28,95.16 C45.1 60.05,94.89 60.96,93.98 60.96,91.96 C46.1 | v60.71,88.65 60.71,89.95 C46.1
N$75
  Top 0.203: LED4.A 26.45,17.4 26.45,19.15 R17.2
NOISE1
  Top 0.406: R9.2 50.1,95.65 50.57,95.18 D1.P$2 50.3,92.1 U3.3
  Bottom 0.406: U4.2 54.1,92.65 53.6,92.15 50.78,92.15 D1.P$2
NOISE2
  Top 0.406: U3.2 50.25,90.83 D4.P$2 50.5,90.52 50.5,88.25 49.9,87.65 R13.2
  Bottom 0.406: U4.6 55.37,89.88 54.6,90.65 50.63,90.65 D4.P$2
NRF_GPIO  (via drill 0.33)
  Top 0.203: U9.9 33.1,23.15 32.1,24.15 v32.1,25.55 | U6.38 37.1,46.15 38.6,44.65 38.6,44.15 40.1,42.65 40.1,38.9 v32.91,31.61
  Bottom 0.203: 32.43,31.03 v32.91,31.61 | 32.43,31.03 32.53,26.04 v32.1,25.55 | 32.43,31.03 32.48,31.16 31.5,32.14 25.6,32.14 24.8,31.34 24.8,29.64 24.1,29 22.28,29 J5.8
NRF_INT  (via drill 0.33)
  Top 0.203: U6.67 36.77,59.65 v38.51,59.65 43.5,64.64 43.5,73.07 J3.3 | U9.6 34.3,23.1 37.52,26.42 37.52,28.36 38.1,29.04 39.71,29.04 40.18,29.52 40.18,35.44 44.6,39.85 44.6,50.54 45.72,51.66 v45.72,58.06
  Bottom 0.203: v45.72,58.06 44.13,59.65 v38.51,59.65
NRF_LED  (via drill 0.33)
  Top 0.203: U9.19 30.15,16.95 v30.1,16.9 | R17.1 v26.6,22.65
  Bottom 0.203: v30.1,16.9 26.6,20.4 v26.6,22.65
NRF_SWDCLK  (via drill 0.33)
  Top 0.203: U9.24 30.4,14.95 30.1,14.65 v30.1,13.65 | TC1.4 20.46,13.88 22.31,13.88 25.54,10.65 27.6,10.65 28.45,11.5 R6.1 28.45,11.8 28.6,11.65 v29.6,11.65
  Bottom 0.203: v30.1,13.65 30.1,12.15 v29.6,11.65
NRF_SWDIO  (via drill 0.33)
  Top 0.203: U6.46 42.26,46.65 v42.6,46.65 | J6.3 51.19,30.24 50.2,29.19 50.2,24.84 v48.5,23.14 | 28.32,15.35 R18.1 | R18.1 28.3,15.46 | U9.23 30.4,15.35 v30.1,15.65 R18.1 | R18.1 28.45,15.8 27.6,16.65 22.79,16.65 22.29,17.15 20.6,17.15 19.85,16.4 19.85,14.65 19.48,14.29 TC1.2
  Bottom 0.203: v42.6,46.65 46.6,46.65 48.6,44.65 48.6,35.4 51.46,32.54 J6.3 | v30.1,15.65 34.85,20.4 34.85,22.76 35.56,23.47 39.83,23.47 41.96,21.34 46.69,21.34 v48.5,23.14
NRF_TWI_SCL  (via drill 0.33)
  Top 0.203: U9.4 35.1,21.44 v36.44,22.79
  Bottom 0.203: U1.10 59.1,11.24 57.7,9.84 48.83,9.84 45.87,12.8 45.87,18.49 43.38,20.98 41.6,20.98 39.83,22.76 36.48,22.76 v36.44,22.79
NRF_TWI_SDA  (via drill 0.33)
  Top 0.203: U9.3 35.5,20.64 v36.5,21.64 | v55.5,9.14 56.5,10.14 56.5,16.64 v56,17.14
  Bottom 0.203: v55.5,9.14 48.11,9.14 44.81,12.45 42.67,12.45 37.34,17.78 37.34,20.98 36.67,21.64 v36.5,21.64 | v56,17.14 56.69,16.45 U1.2
RF233_!RST  (via drill 0.33)
  Top 0.203: U6.47 42.21,47.4 v43.1,47.4 | v24.85,50.15 30.6,50.15 v31.1,49.65 | U2.8 18.83,85.98 15.7,82.84 v15.7,80.24
  Bottom 0.203: v24.85,50.15 23.35,50.15 17.5,56 17.5,62.64 14.5,65.64 14.5,71.64 15.7,72.84 v15.7,80.24 | v31.1,49.65 33.35,47.4 v43.1,47.4 46.85,47.4 49.35,44.9 49.35,36.4 54,31.75 J6.2
RF233_CS  (via drill 0.33)
  Top 0.203: U2.23 25.85,81.41 25.85,81.4 25.85,80.4 26.61,79.64 27.5,79.64 30.01,82.15 v30.6,82.15
  Bottom 0.203: U13.10 37.8,82.35 38.1,82.65 38.1,84.15 37.6,84.65 33.1,84.65 v30.6,82.15
RF233_IRQ  (via drill 0.33)
  Top 0.203: U2.24 26.35,80.8 v26.6,80.55 | U6.44 42.34,45.15 v42.6,45.15
  Bottom 0.203: v42.6,45.15 46.23,45.15 47.3,44.09 47.3,31.16 J6.5 46.36,30.24 44.59,32.16 43.14,32.16 30.85,44.4 28.24,44.4 17,55.64 17,62.14 14.07,65.07 14.07,71.72 13.1,72.69 13.2,79.44 14.91,81.15 26,81.15 v26.6,80.55
RF233_MISO  (via drill 0.33)
  Top 0.203: v25.6,79.65 25.1,79.65 24.35,80.4 U2.20
  Bottom 0.203: U13.2 32.1,79.15 26.1,79.15 v25.6,79.65
RF233_MOSI  (via drill 0.33)
  Top 0.203: U2.22 25.35,81.4 25.35,80.9 v25.1,80.55
  Bottom 0.203: U13.3 32.8,81.35 31.1,79.65 26.6,79.65 25.7,80.55 v25.1,80.55
RF233_SCK  (via drill 0.33)
  Top 0.203: U2.19 23.85,81.4 23.85,79.9 25.1,78.65 30.6,78.65 31.6,79.65 31.6,83.15 33.6,85.15 35.6,85.15 v37.1,83.65
  Bottom 0.203: U13.9 37.1,83.55 v37.1,83.65
RF233_SLP  (via drill 0.33)
  Top 0.203: U2.11 18.92,84.48 18.2,83.65 v18.2,79.84 | U6.48 42.17,48.15 v42.6,48.15 | v23.85,50.9 v30.1,50.9
  Bottom 0.203: v23.85,50.9 23.35,50.9 18,56.25 18,63.14 15,66.14 15,70.64 16,71.64 17.5,71.64 18.2,72.34 v18.2,79.84 | J6.1 56.54,30.46 50.1,36.9 50.1,45.15 47.1,48.15 v42.6,48.15 33.6,48.15 30.85,50.9 v30.1,50.9
SCK  (via drill 0.33)
  Top 0.203: U6.11 24.6,46.07 24.6,45.15 v23.35,43.9 | v14,61.64 24.55,72.19 J2.6 25.9,74.76 25.9,77.04 26.5,77.64 31.5,77.64 33.01,79.15 v36.1,79.15
  Route15 0.203: v36.1,79.15 34.1,81.15 v34.1,84.05
  Bottom 0.203: v23.35,43.9 22.35,43.9 14,52.25 v14,61.64 | v34.1,84.05 34.1,84.15 35.1,84.15 35.35,83.9 U13.8
SENSE_TWI_SCL  (via drill 0.33)
  Top 0.203: 51.98,18.9 U10.5 52.04,18.9 53.6,18.9 54.1,18.4 v54.1,17.4 54.1,15.4 53.73,15.04 U11.4 | U8.6 52.35,20.43 v52.35,20.4
  Bottom 0.203: v52.35,20.4 52.35,17.9 52.85,17.4 v54.1,17.4 55.16,17.4 55.9,18.14 57,18.14 58.1,17.04 U1.3
SENSE_TWI_SDA  (via drill 0.33)
  Top 0.203: U8.1 54.3,20.35 53.55,19.6 | 53.55,19.6 53.35,19.4 52.04,19.4 U10.6 51.98,19.4 51.6,19.4 51.35,19.15 51.35,17.15 51.74,16.76 U11.6 | v60.5,13.64 60,14.14 60,17.14 57.5,19.64 53.59,19.64 arc90 53.55,19.6
  Bottom 0.203: U1.9 60,13.45 60.31,13.45 v60.5,13.64
SPI_NCS0  (via drill 0.33)
  Top 0.203: v12.85,48.15 21.74,48.15 U6.4
  Route15 0.203: J2.2 14.27,73.41 v11,70.14
  Bottom 0.203: v12.85,48.15 12.85,48.29 11,50.14 v11,70.14
SPI_NCS1  (via drill 0.33)
  Top 0.203: v14.1,48.9 21.85,48.9 22.76,49.82 U6.3
  Route15 0.203: v13,69.64 16.5,73.14 16.66,73.14 J2.3
  Bottom 0.203: v14.1,48.9 13.24,48.9 11.5,50.64 11.5,68.14 v13,69.64
SPI_NCS2  (via drill 0.33)
  Top 0.203: U6.1 22,50.64 v14.2,50.64 | J2.5 22.01,70.65 13,61.64 v13,60.64
  Bottom 0.203: v14.2,50.64 13,51.64 v13,60.64
SPI_NCS3  (via drill 0.33)
  Top 0.203: U6.2 21.82,49.65 v15.5,49.65 | J2.4 20.8,74.74 20.8,77.34 21.6,78.14 31,78.14 33,80.14 38,80.14 39,81.14 v39,81.64
  Route15 0.203: v13,68.14 14.2,68.14 J2.4
  Bottom 0.203: v15.5,49.65 13.49,49.65 12,51.14 12,67.14 v13,68.14 | v39,81.64 38.79,81.85 U13.11
SWDCLK/TCK
  Top 0.203: U6.18 27.4,43.92 27.4,37.95 25.85,36.4 22.35,36.4 20.35,34.4 17.76,34.4 14.5,31.14 14.5,21.45 15,20.95 17.2,20.95 18.15,21.9 TC2.4
SWDIO/TMS  (via drill 0.33)
  Top 0.203: U6.19 27.8,43.61 27.8,37.65 26,35.85 22.93,35.85 v22.17,35.09 | v12.6,20.65 12.6,19.35 14.3,17.65 17.1,17.65 17.9,18.35 17.9,20.32 TC2.2
  Bottom 0.203: v12.6,20.65 12.6,27.65 20.04,35.09 v22.17,35.09
TRNG_EN  (via drill 0.6)
  Top 0.203: U6.63 37.6,57.65 38.6,57.65 48.93,67.98 J3.5 48.93,73.98 49.6,74.65 54.8,74.65 55.3,75.15 55.3,77.35 57.1,79.15 v58.1,79.15
  Top 0.406: SJ6.1 54.9,80.8 R16.2 59.6,79.65 59.1,79.15 v58.1,79.15
  Bottom 0.406: U12.4 57.6,80.8 57.6,79.65 v58.1,79.15
TRNG_OUT
  Top 0.203: U6.64 37.39,58.15 38.24,58.15 46.58,66.5 46.58,73.22 J3.4 45.2,74.6 45.2,88.75 46.01,89.56 U3.1
  Top 0.406: U3.1
TRNG_PWR_EN  (via drill 0.33)
  Top 0.203: U6.77 29.5,61.53 29.5,63.64 37.5,71.64 39,71.64 40.1,72.74 40.1,78.54 v39.5,79.14
  Bottom 0.203: v39.5,79.14 39.5,79.64 39.73,79.88 U14.4
TWI1_SCL  (via drill 0.33)
  Top 0.203: v30.35,45.15 30.35,44.75 U6.21 | v16,68.64 16,69.44 13.1,72.34 13.1,74.75 JP1.SCL
  Bottom 0.203: v30.35,45.15 30.35,45.4 26.1,49.65 26.1,49.9 24.35,51.65 24.1,51.65 20,55.75 20,60.14 19.43,60.71 R2.1 18.6,61.72 18.6,63.64 15.5,66.74 15.5,68.14 v16,68.64
TWI1_SDA  (via drill 0.33)
  Top 0.203: v29,47.7 29.1,47.6 29.1,46.3 29.55,45.85 29.55,44.66 U6.20 28.77,43.93 | JP1.SDA 14.49,75.95 15.7,74.74 15.7,71.14 v18,68.84
  Bottom 0.203: v29,47.7 20.6,56.15 20.6,65.36 R1.1 | R1.1 19.82,66.14 | v18,68.84 18,67.96 R1.1
TWI2_SCL  (via drill 0.33)
  Top 0.203: 24.1,60.15 24.1,56.33 U6.92 25.4,55.03 25.4,53.35 v26.3,52.45 | J2.10 34.71,70.76 24.1,60.15 | v58,18.14 v58,11.14 | 24.1,60.15 24.1,62.55 R25.1 | v58.12,31.89 55.38,34.64 v46.5,34.64
  Bottom 0.203: v26.3,52.45 31.2,47.55 31.2,44.95 35.1,41.05 35.7,41.05 42.12,34.64 v46.5,34.64 | U1.4 58.6,17.54 v58,18.14 58,23.14 58.12,23.27 v58.12,31.89 | U1.11 58.6,11.74 v58,11.14
TWI2_SDA  (via drill 0.33)
  Top 0.203: v26.1,53.65 26.1,55.03 U6.91 24.6,56.53 24.6,59.65 38.36,73.41 J3.1 | v44.88,35.39 55.5,35.39 61,29.89 v61,17.64
  Route15 0.203: v61,17.64 59.5,17.64 58,16.14 56,16.14 v55.5,15.64
  Bottom 0.203: v26.1,53.65 31.85,47.9 31.85,45.4 35.45,41.8 38.45,41.8 38.85,41.4 | 38.85,41.4 44.87,35.39 v44.88,35.39 | R8.1 38.85,41.4 | U1.8 60.76,14.9 61,15.14 v61,17.64 | v55.5,15.64 55.74,15.4 U1.1
USART0_CLK  (via drill 0.33)
  Top 0.203: U6.90 27.1,54.74 v27.1,53.65
  Bottom 0.203: v27.1,53.65 26.35,54.4 24.1,54.4 22.1,56.4 22.1,70.45 20.8,71.75 20.8,74.76 22,75.95 JP1.D13
USART0_CTS  (via drill 0.33)
  Top 0.203: U6.75 33.35,61.89 v33.35,62.9
  Bottom 0.203: JP1.D9 32.3,75.95 33.45,74.9 33.45,63.01 v33.35,62.9
USART0_RTS  (via drill 0.33)
  Top 0.203: v26.35,60.4 25.44,59.49 25.44,57.11 U6.89
  Bottom 0.203: v26.35,60.4 26.35,70.29 28.3,72.24 28.3,74.58 JP1.D10
USART0_RX  (via drill 0.33)
  Top 0.203: U6.93 23.6,56.12 23.6,59.65 v22.85,60.4
  Bottom 0.203: v22.85,60.4 22.85,72.07 23.3,72.52 23.3,74.74 24.51,75.95 JP1.D12
USART0_TX  (via drill 0.33)
  Top 0.203: U6.94 23.1,55.91 23.1,59.15 v22.85,59.4
  Bottom 0.203: v22.85,59.4 23.7,60.25 23.7,70.74 25.8,72.84 25.8,74.74 27.01,75.95 JP1.D11 27.09,75.95
USART2_CLK  (via drill 0.33)
  Top 0.203: U9.5 34.7,22.25 38.6,26.15 39.67,26.15 40.89,27.38 40.89,35.45 45.35,39.9 45.35,49.49 v45.5,49.64 | J3.2 41.25,73.36 41.25,72.9 39.5,71.14 38,71.14 30,63.14 30,61.74 U6.76 30.89,60.84 31.5,60.84 34.14,58.21 34.14,52.98 33,51.85 v33,50.64
  Bottom 0.203: v33,50.64 35,48.64 41.5,48.64 42.5,49.64 v45.5,49.64
USART2_CTS
  Top 0.203: U6.37 38.1,44.45 38.1,37.65 31.35,30.9 31.35,30.4 31.19,30.24 J5.4 31.14,30.19 29.92,29 29.92,25.16 32.7,22.3 U9.10
USART2_RTS
  Top 0.203: U6.36 37.6,44.24 37.6,37.9 31.35,31.65 29.6,31.65 28.6,30.65 J5.5 27.36,29.04 27.36,26.3 32.3,21.45 U9.11
USART2_RX
  Top 0.203: J5.3 | U6.40 40.85,43.82 40.85,38.9 33.68,31.73 J5.3 | U9.8 33.5,25.5 32.52,26.65 32.47,29.11 J5.3
USART2_TX
  Top 0.203: U6.41 41.35,44.03 41.35,38.4 36.35,33.4 36.35,30.37 J5.2 34.97,28.94 34.97,26.47 33.9,25.45 U9.7
USART3_RTS  (via drill 0.33)
  Top 0.203: U6.45 42.3,45.9 v43.1,45.9 | v52.5,65.64 47.5,60.64 47.5,58.14 46.35,56.99 v46.35,45.9
  Bottom 0.203: v43.1,45.9 v46.35,45.9 47.85,44.4 47.85,33.65 48.92,32.58 J6.4 | v52.5,65.64 52.5,67.64 55.5,70.64 57.4,70.64 58.4,69.64 58.4,68 U7.19
USART3_RX  (via drill 0.33)
  Top 0.203: U6.73 35.6,62.73 v35.6,63.65 | JP1.D0 56.6,75.44 55.3,74.14 55.3,71.54 51.95,68.19 | 51.95,68.19 v48.9,65.14 | 51.95,68.19 54.85,68.19 v55.3,68.64
  Route15 0.203: v48.9,65.14 37,65.14 35.6,63.74 v35.6,63.65
  Bottom 0.203: U7.17 57.4,68 57.4,68.74 57,69.14 55.8,69.14 v55.3,68.64
USART3_TX  (via drill 0.33)
  Top 0.203: U6.74 34.1,61.93 34.1,63.65 42.6,72.15 v42.6,77.44
  Bottom 0.203: v42.6,77.44 43.3,78.14 52.5,78.14 54.06,76.58 JP1.D1 55.25,74.76 55.25,72.39 56,71.64 57.58,71.64 57.59,71.65 59.8,69.44 59.8,67.18 U7.1
USB_N
  Top 0.203: U6.98 22.13,54.05 14.04,54.05 R20.2
USB_P
  Top 0.203: U6.99 21.93,53.54 14.69,53.54 R21.2
USER_BTN  (via drill 0.33)
  Top 0.203: U6.79 28.46,61.15 28.5,61.19 v28.5,62.14 | v8.89,75.39 8.89,82.5 SW2.2 SW2.1
  Route15 0.203: J2.9 32.17,73.8 31.29,74.68 9.6,74.68 v8.89,75.39
  Bottom 0.203: J2.9 32.17,72.81 29.5,70.14 29.5,70.13 | v28.5,62.14 28.5,64.14 29.5,65.14 29.5,70.13 | 29.5,70.13 R3.1
USER_LED  (via drill 0.33)
  Top 0.203: U6.39 39.6,44.36 v39.6,44.15 | v52.1,47.65 52.1,47.17 R24.1
  Route15 0.203: v39.6,44.15 48.6,44.15 v52.1,47.65
VCC_3V3  (via drill 0.6)
  Top 0.406: C16.1 4.71,45.34 v3.5,45.34
  Bottom 0.406: U5.5 3.5,45.96 v3.5,45.34
  pour Route15: 6.35,26.31 1.27,26.31 1.27,54.25 6.35,54.25
VCC_BATT  (via drill 0.6)
  Top 0.406: J1.2 7.89,65.64 v3,65.64
  Bottom 0.406: v3,65.64 2.03,64.67 D7.A
VCC_DBG_USB_5V  (via drill 0.6)
  Top 0.406: USB2.VBUS 55.89,55.03 54.5,53.64 54.5,52.14 v54.42,52.06 54.42,50.82 R4.1
  Bottom 0.203: D2.A v54.42,52.06 53.49,52.98 C17.1 52.92,60.56 56.06,63.7 U7.11 U7.12
VCC_EXT_5V  (via drill 0.6)
  Top 0.406: v22.1,25.65 19.24,25.65 18.23,26.66 D9.A
  Route15 0.406: 29.85,26.4 31.14,27.69 JP1.5V | JP1.VIN 37.53,26.4 29.85,26.4 | v22.1,25.65 29.1,25.65 29.85,26.4
VCC_IN  (via drill 0.6)
  Top 0.406: v16,28.64 16,29.97 D9.C
  Bottom 0.406: U5.3 4.76,50.38 4.5,50.64 3.2,50.64 2.9,50.34 2.9,49.24 U5.1 2.06,49.2 1.5,48.64 | C8.1 2.96,44.18 | 1.5,48.64 1.5,45.14 2.55,44.09 C8.1 | v10,40.64 5,40.64 2.96,42.68 C8.1 | v4.5,59.14 2.56,59.14 D7.C 2.03,57.8 2.88,56.95 D3.C 2.81,55.14 2,55.14 1.5,54.64 1.5,48.64 | D2.C 59.28,50.34 59.28,48.14 v60.86,46.57
  pour Route15: 10.5,70.14 10.5,31.64 59,31.64 59,77.14 61.5,77.14 61.5,26.14 7.5,26.14 7.5,55.64 1.5,55.64 1.5,70.14
VCC_MCU_3V3  (via drill 0.33, 0.6)
  Top 0.203: C22.2 22.6,44.84 22.6,46.15 24.53,48.08 | 24.53,48.08 25.4,48.95 v25.6,48.95 | 24.53,48.08 U6.8 | C19.2 19.1,55.66 v19.1,56.95 | U6.97 21.74,55.15 | R25.2 v25.35,67.9 | U6.57 39.03,54.84 38.1,53.9 v37.35,53.9 | L1.2 42.75,57.55 v41.85,56.65 | R26.2 17.2,38.75 v16.3,38.75 | TC2.1 19.48,20.47 19.8,20.15 19.8,17.94 19,17.14 13.5,17.14 11,19.64 v11,22.14 | U6.17 28.33,45.55 v28.8,45.55 | U6.87 26.2,57.76 26.2,58.75 | v27.1,59.65 26.2,58.75 | 26.2,58.75 25.9,58.45 25.9,57.35 U6.88 | JP1.IOREF 22.25,29.02 v22.25,33.04 | v47.7,20.62 47.7,31.65 v49.43,33.43
  Top 0.406: C21.1 12.54,47.09 v13.97,47.09 | 21.74,55.15 20,55.15 | 20,55.15 18.6,55.15 | C18.2 20.66,55.81 20,55.15
  Route2 0.203: JP1.3.3V 27.41,28.94 24.9,28.94 23.65,27.69 JP1.IOREF
  Route15 0.203: 36.6,71.65 37.1,72.15 v37.1,76.65
  Bottom 0.203: C15.2 27.53,59.23 v27.1,59.65 | C14.2 33.95,54.76 v32.85,53.65 | v43.1,39.65 42.2,40.25 R8.2 42.25,41.39 | U13.14 35.51,80.14 36.5,80.14 37.1,79.54 v37.1,76.65 | R2.2 19.55,62.47 R1.2 17.12,67.14 v16.5,67.14 | R3.2 27.97,65.61 v27.5,65.14 | J4.3.2 11,28.86 v11,22.14 | U1.14 50.53,14.9 47.65,17.78 v47.7,20.62
  Bottom 0.406: J4.3.2 8.76,34.64 v15.54,34.64
  pour Route15: 11.43,32.66 57.96,32.66 57.96,71.72 11.43,71.72
VCC_NRF_3V3  (via drill 0.33, 0.6)
  Top 0.203: U9.1 36.3,20.35 37.1,21.15 | 14.29,13.85 17.7,13.85 18.02,14.17 TC1.1 | U9.12 30.7,20.05 | 30.7,20.05 30.5,20.05 29.85,19.4 | 30.7,20.05 v30.1,20.65 | U9.35 35.9,13.76 36.3,13.36 U9.36 | v57.3,12.44 57.3,9.94 55.5,8.14 47.5,8.14 v44,11.64
  Top 0.406: R18.2 25.6,15.65 v24.6,14.65 24.6,12.65 25.6,11.65 R6.2 | 29.85,19.4 28.7,19.4 C31.1 | 36.3,13.36 C38.1 37.25,12.65 38.1,12.65 v38.85,13.4 | 37.1,21.15 38.35,21.15 v39.1,21.9 | 14.29,13.85 v13.25,14.89
  Route15 0.406: J4.5.2 7.01,22.65 7,22.64
  Bottom 0.203: U1.12 58.1,12.74 57.6,12.74 | U1.13 57.6,12.74 | 57.6,12.74 v57.3,12.44
  Bottom 0.406: v39.1,21.9 39.1,20.25 C33.1 C32.1
  pour Route15: 1.13,25.04 1.13,9.8 44.45,9.8 44.45,25.04
VCC_RF233_3V3  (via drill 0.33)
  Top 0.203: U2.28 27.42,83.48 v29.6,85.65 C5.1 | C13.1 v21.2,82.9 21.63,82.48 U2.15 | v37.6,81.15 34.1,81.15 v32.6,82.65
  Route15 0.406: J4.1.2 7,37.96 7,80.14
  Bottom 0.203: U13.12 37.4,81.35 v37.6,81.15 37.3,80.85 U13.13 | U13.6 32.8,82.85 v32.6,82.65 32.9,82.35 U13.5
  pour Route15: 1.43,93.62 1.43,78.38 38.1,78.38 38.1,93.62
VCC_SENSE_3V3  (via drill 0.33, 0.6)
  Top 0.203: U10.1 50.66,20.34 v49.35,21.65 | U11.1 52.6,13.45 v52.6,11.4 52.34,11.14 50,11.14 C43.1 50.7,11.85 50.7,13.22 U11.14
  Top 0.406: U8.5 U8.4 51.35,23.43 51.35,23.9 51.85,24.4 53.85,24.4 54.3,23.96 U8.3 55.84,23.39 v55.85,23.4
  Route15 0.406: 45.99,21.65 v49.35,21.65 | J4.4.2 9.37,30.27 13,26.64 20,26.64 21,25.64 21,25.14 21.5,24.64 23,24.64 23.5,24.14 39.86,24.14 43.03,20.98 46.23,20.98
  Bottom 0.203: v49.35,21.65 49.6,21.4 R7.2 51.35,20.55 C40.1 51.35,18.9 | U1.5 59.1,18.24 v59.5,18.64 59.6,18.54 U1.6
  Bottom 0.406: C29.1 52.45,23.4 v55.85,23.4
  pour Route15: 45.72,25.04 45.72,9.8 60.96,9.8 60.96,25.04
VCC_TARGET_USB_5V  (via drill 0.6)
  Top 0.406: R5.1 7.75,47.89 v9.5,49.64 | v9.5,58.64 9.5,58.57 5.69,54.76 4.65,54.76 USB1.VBUS
  Bottom 0.406: D3.A 8.07,55.21 9.5,56.64 | v9.5,49.64 9.5,56.64 | 9.5,56.64 v9.5,58.64
VCC_TRNG_3V3  (via drill 0.6)
  Top 0.406: 53.2,81.7 SJ6.2 53.15,79.6 53.6,79.15 v55.1,79.15 | v54.1,85.65 53.1,84.65 53.1,84.25 L3.2 53.2,81.7 | U3.8 41.88,89.12 C44.1 41.1,86.89 v41.1,85.15 | 53.2,81.7 51.15,81.7 v51.1,81.65
  Route15 0.406: v41.1,85.15 41.1,83.15 42.6,81.65 v51.1,81.65
  Bottom 0.203: U14.1 40.39,84.44 v41.1,85.15
  Bottom 0.406: C48.1 55.1,86.65 v54.1,85.65 | U12.5 55.6,80.8 55.6,79.65 v55.1,79.15
VHIGH  (via drill 0.6)
  Top 0.406: R10.2 R11.2 R14.2 C11.1 52.79,86.65 v52.1,86.65 50.6,86.65 49,85.05 C10.+ | D6.C 59.6,84.23 59.6,86.65 v59.1,87.15
  Route15 0.406: v59.1,87.15 52.6,87.15 v52.1,86.65
  Bottom 0.406: C7.1 50.91,88.7 U4.8 52.83,87.38 v52.1,86.65 | C47.1 59.95,86.3 v59.1,87.15
VHIGHSAMPLE  (via drill 0.33)
  Top 0.203: U6.29 34.25,42.64 v35.5,42.64 | v46.3,42.64 46.5,42.64 47.5,43.64 47.5,56.64 48.5,57.64 48.5,60.14 v60,71.64 | v59.18,89.66 57.95,90.89 R12.2
  Top 0.406: R11.1 56.32,90.89 R12.2
  Bottom 0.203: v35.5,42.64 v46.3,42.64 | v60,71.64 60,77.54 61.21,78.76 61.21,86.87 59.18,88.9 v59.18,89.66

## Text on the board
tPlace: Designed for TockOS / www.tockos.org | R9 | B1 | D1 | C2 | C3 | C4 | C5 | R10 | R12 | U3 | R11 | R14 | C11 | D5 | C44 | R13 | R15 | C13 | U2 | L3 | C10 | D4 | D6 | SJ6 | USER | R30 | SCL1 | SDA1 | AREF | GND | CLK0 | RX0 | TX0 | RTS0 | CTS0 | D8 | D7 | D6 | D5 | D4 | D3 | D2 | TX3 | RX3 | J2 | GND | !CS0 | !CS1 | !CS3 | !CS2 | SCK | MOSI | MISO | USER_BTN | SCL2 | SDA2 | CLK2 | NRF_INT | TRNG_OUT | TRNG_EN | GND | GND | GND | J3 | R25 | BATT | ATSAM4LC8 | KERNEL | U6 | R19 | L1 | R20 | C19 | C18 | DEBUG | C20 | R21 | TARGET | R4 | C21 | R5 | C22 | USB | X2 | R24 | USB | C16 | USER | C23 | L2 | C24 | C25 | R26 | RF233 | PWR MEASURE | C27 | C26 | TRNG | C28 | MCU | D9 | NRF / GPIO | EXT | LIGHT | RTS2 | CTS2 | RX2 | TX2 | ACC1 | ACC2 | RF233_IRQ | RTS3 | NRF_SWDIO | !RF233_RST | RF233_SLP | SENSE | NRF | J5 | IOREF | !RST | 3V3 | 5V | GND | GND | VIN | A0 | A1 | A2 | A3 | A4 | A5 | J6 | MCUSWD | RESET | C31 | U8 | U9 | C34 | R17 | NRFSWD | NRF | C41 | U10 | R18 | C35 | U11 | X3 | C36 | C42 | R6 | C37 | B2 | C38 | C39 | C43 | Shane Leonard / v2.1 9/17 | IMIX | www.github.com/helena-project/imix
bPlace: Helena Project | True RNG / Ben Lampert / 7/2016 | C45 | U4 | C46 | C6 | C7 | C1 | C48 | C12 | X1 | C47 | U12 | SCL1 | SDA1 | AREF | AREF | GND | CLK0 | RX0 | TX0 | RTS0 | D8 | D7 | D6 | D5 | D4 | D3 | D2 | GND | !CS0 | !CS1 | !CS3 | !CS2 | SCK | MOSI | MISO | USER_BTN | SCL2 | SDA2 | CLK2 | NRF_INT | TRNG_OUT | TRNG_EN | GND | GND | GND | U7 | R1 | R3 | C30 | D7 | R2 | R22 | D3 | C14 | C15 | R23 | C17 | D2 | U5 | C8 | R8 | NRF_GPIO | EXTINT1 | LIGHT_INT | RTS2 | CTS2 | RX2 | TX2 | ACC_INT1 | ACC_INT2 | RF233_IRQ | RTS3 | NRF_SWDIO | !RF233_RST | RF233_SLP | NC | IOREF | !RST | 3V3 | 5V | GND | GND | VIN | A0 | A1 | A2 | A3 | A4 | A5 | C29 | R7 | C32 | C40 | C33 | Stanford EE/CS
tDocu: J2 | J3 | J4 | J5 | J6 | IMIX v2.1 Sep 2017 / Shane Leonard | PCB Top
bDocu: ( indicates fiducial) | Red | Solder Mask Color | 1 oz | Outer Copper Weight | 0.5 oz | Inner Copper Weight | 0.063" | PCB Thickness | PCB Bottom